# Altium schematic sheet USB_to_UART.SchDoc
size A4; SheetNumber: 6; SheetTotal: 8
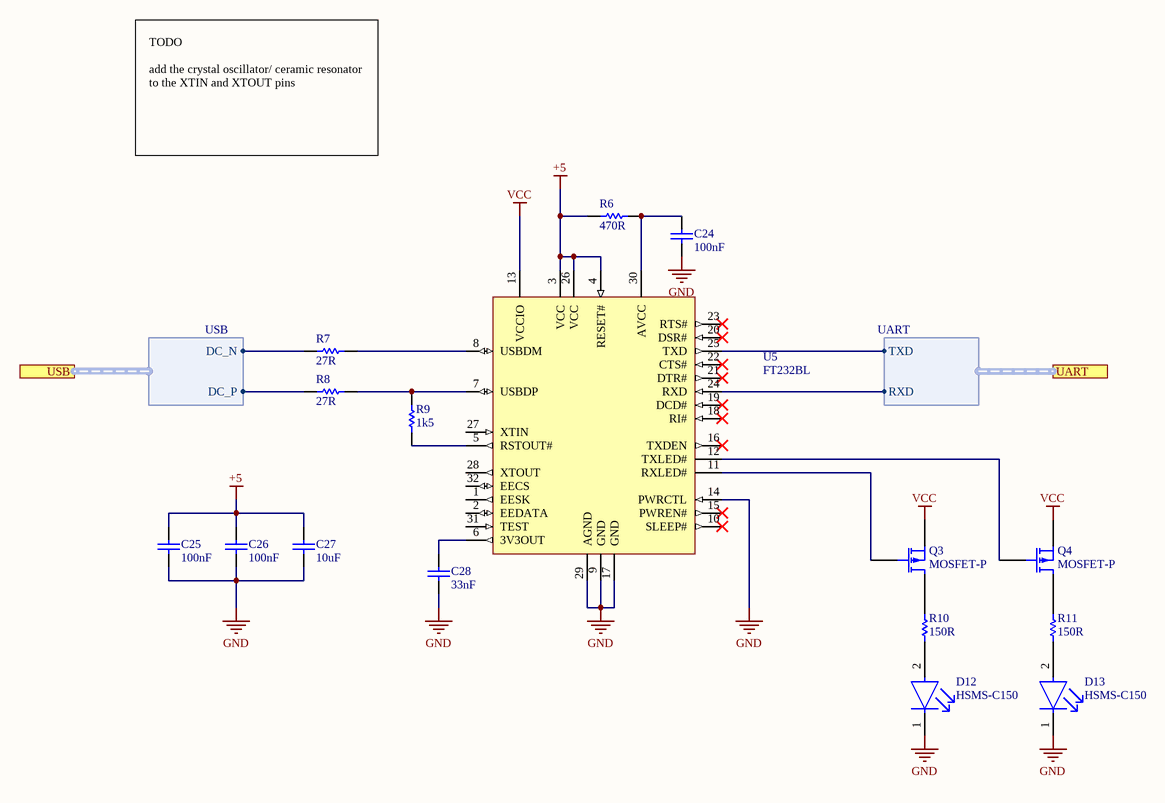
[diagram p0: USB_to_UART.SchDoc]

## Parts
C24  100nF
C25  100nF
C26  100nF
C27  10uF
C28  33nF
D12  HSMS-C150  [FP-HSMS-C150-MFG]
D13  HSMS-C150  [FP-HSMS-C150-MFG]
Q3  MOSFET-P  [Tran SOT23]
Q4  MOSFET-P  [Tran SOT23]
R6  470R
R7  27R
R8  27R
R9  1k5
R10  150R  [RES 0603 SILK]
R11  150R  [RES 0603 SILK]
U5  FT232BL  [LQFP-32_L]

## Ports
UART (harness UART), USB (harness USB)

## Harnesses
USB: DC_N, DC_P
UART: RXD, TXD

## Nets
+5: C25.2 C26.2 C27.2 R6.1 U5.3(VCC) U5.4(RESET#) U5.26(VCC)
GND: C24.1 C25.1 C26.1 C27.1 C28.1 D12.1(C) D13.1(C) U5.9(GND) U5.14(PWRCTL) U5.17(GND) U5.29(AGND)
VCC: Q3.2(S) Q4.2(S) U5.13(VCCIO)
NetC24_2: C24.2 R6.2 U5.30(AVCC)
NetC28_2: C28.2 U5.6(3V3OUT)
NetD12_2: D12.2(A) R10.1
NetD13_2: D13.2(A) R11.1
NetQ3_1: Q3.1(G) U5.11(RXLED#)
NetQ3_3: Q3.3(D) R10.2
NetQ4_1: Q4.1(G) U5.12(TXLED#)
NetQ4_3: Q4.3(D) R11.2
NetR7_1: R7.1 ; port USB.DC_N
NetR7_2: R7.2 U5.8(USBDM)
NetR8_1: R8.1 ; port USB.DC_P
NetR8_2: R8.2 R9.2 U5.7(USBDP)
NetR9_1: R9.1 U5.5(RSTOUT#)
NetU5_24: U5.24(RXD) ; port UART.RXD
NetU5_25: U5.25(TXD) ; port UART.TXD

Not connected (* = marked no-connect by the designer): U5 1(EESK) 2(EEDATA) 10(SLEEP#)* 15(PWREN#)* 16(TXDEN)* 18(RI#)* 19(DCD#)* 20(DSR#)* 21(DTR#)* 22(CTS#)* 23(RTS#)* 27(XTIN) 28(XTOUT) 31(TEST) 32(EECS)

## Notes on the sheet
- TODO
  add the crystal oscillator/ ceramic resonator to the XTIN and XTOUT pins

## Library data of the parts
C24-C26 = 100nF: Capacitor; Published: 8-Jun-2000; LatestRevisionDate: 17-Jul-2002; LatestRevisionNote: Re-released for DXP Platform.; PackageReference: RAD-0.3; Publisher: Altium Limited; PackageDescription: Radial Cap, Thru-Hole; 2 Leads; 0.3 in Pin Spacing
C27 = 10uF: 10uF ceramic Capacitor; Published: 8-Jun-2000; LatestRevisionDate: 17-Jul-2002; LatestRevisionNote: Re-released for DXP Platform.; PackageReference: RAD-0.3; Publisher: Altium Limited; PackageDescription: Radial Cap, Thru-Hole; 2 Leads; 0.3 in Pin Spacing
C28 = 33nF: 33nF ceramic Capacitor; Published: 8-Jun-2000; LatestRevisionDate: 17-Jul-2002; LatestRevisionNote: Re-released for DXP Platform.; PackageReference: RAD-0.3; Publisher: Altium Limited; PackageDescription: Radial Cap, Thru-Hole; 2 Leads; 0.3 in Pin Spacing
D12 D13 = CMP-21615-000001-1: LED RED DIFFUSED CHIP SMD; Luminous Intensity: 10mcd; Power Dissipation: 65mW; Viewing Angle: 170°; Number of Elements: 1; Forward Current: 20mA; Lens Color: White; Lens Style: Rectangular; Wavelength: 626nm; Forward Voltage: 2.1V; Reverse Voltage: 5V; Number of Pins: 2; Color: Red; Lead Free: Lead Free; Width: 1.6mm; Length: 3.2mm; REACH SVHC: No SVHC; Height: 1.1mm; Depth: 1.6mm; Power Rating: 65mW; Package Quantity: 1; Illumination Color: Red; Radiation Hardening: No; Case Code (Imperial): 1206; Max Operating Temperature: 85°C; Test Current: 20mA; Case/Package: 1206; Lens Transparency: Diffused; Number of LEDs: 1; Packaging: Tape and Reel; Mount: Surface Mount; Min Operating Temperature: -40°C; Case Code (Metric): 3216; Dominant Wavelength: 626nm
Q3 Q4 = MOSFET-P: P-Channel MOSFET; Published: 8-Jun-2000; LatestRevisionDate: 17-Jul-2002; LatestRevisionNote: Re-released for DXP Platform.; PackageVersion: 1995/1996; PackageReference: E3; Publisher: Altium Limited; PackageDescription: TO, Flat Index; 3 In-Line, Axial Leads; Body Dia. 4.6mm; Lead Dia. 0.5 mm (max)
R6 = 470R: 470 ohm Resistor; Published: 8-Jun-2000; LatestRevisionDate: 17-Jul-2002; LatestRevisionNote: Re-released for DXP Platform.; PackageReference: AXIAL-0.3; Publisher: Altium Limited; PackageDescription: Axial Device, Thru-Hole; 2 Leads; 0.3 in Pin Spacing
R7 R8 = 27R: Resistor; Published: 8-Jun-2000; LatestRevisionDate: 17-Jul-2002; LatestRevisionNote: Re-released for DXP Platform.; PackageReference: AXIAL-0.3; Publisher: Altium Limited; PackageDescription: Axial Device, Thru-Hole; 2 Leads; 0.3 in Pin Spacing
R9 = 1k5: Resistor; Published: 8-Jun-2000; LatestRevisionDate: 17-Jul-2002; LatestRevisionNote: Re-released for DXP Platform.; PackageReference: AXIAL-0.3; Publisher: Altium Limited; PackageDescription: Axial Device, Thru-Hole; 2 Leads; 0.3 in Pin Spacing
R10 R11 = 150R: Resistor; Published: 8-Jun-2000; LatestRevisionDate: 17-Jul-2002; LatestRevisionNote: Re-released for DXP Platform.; PackageReference: AXIAL-0.3; Publisher: Altium Limited; PackageDescription: Axial Device, Thru-Hole; 2 Leads; 0.3 in Pin Spacing
U5 = CMP-0078-00024-3: USB UART Asynchronous Serial Data Transfer Chip, 0 to +70 degC, 32-pin LQFP, Pb-Free; Manufacturer: FTDI; DatasheetVersion: ver 2.2, Nov-2011; ComponentLink2URL: http://www.ftdichip.com/Support/Documents/DataSheets/ICs/DS_FT232BL_BQ.pdf; ComponentLink1Description: Manufacturer URL; PackageVersion: Nov-11; PackageDescription: 32-Pin Thin Quad Flat Pack, 7 x 7 mm Body, 0.8 mm Pitch; PackageReference: LQFP-32; PartNumber: FT232BL; ComponentLink2Description: Datasheet; ComponentLink1URL: http://www.ftdichip.com/